# Altium schematic sheet CanController.SchDoc
size A4; CompanyName: HESSO; Address1: Route du Rawyl 47; Address2: 1950 Sion; Address3: Switzerland; DocumentNumber: 4; SheetNumber: 3; SheetTotal: 4; PageSetup: Record=PageOptions|CenterHorizontal=True|CenterVertical=True|PrintScale=1.00|XCorrection=1.00|YCorrection=1.00|PrintKind=1|BorderSize=5000000|LeftOffset=0|BottomOffset=0|Orientation=2|PaperLength=1000|PaperWidth=1000|Scale=100|PaperSource=15|PrintQuality=1200|MediaType=1|DitherType=10|PrintScaleMode=1|PaperKind=A4|PaperIndex=9; ProjectName: Project Name
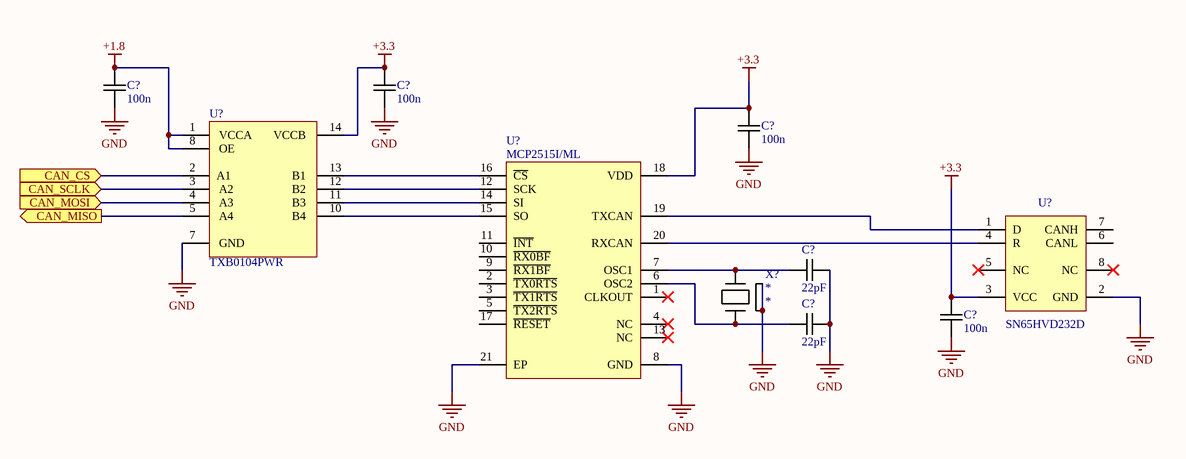
[diagram p0: CanController.SchDoc]

## Parts
(Parts that share a designator on the sheet are numbered #1, #2 ... from top to bottom, then left to right.)
C?#1  100n  [CAPACITOR 1608 REFLOW]
C?#2  100n  [CAPACITOR 1608 REFLOW]
C?#3  100n  [CAPACITOR 1608 REFLOW]
C?#4  22pF  [CAPACITOR 1608 REFLOW]
C?#5  22pF  [CAPACITOR 1608 REFLOW]
C?#6  100n  [CAPACITOR 1608 REFLOW]
U?#1  TXB0104PWR  [TSSOP14 P0.65 C4.4x5.0 H1.1]
U?#2  MCP2515I/ML  [QFN20 P0.5 T2.05x2.05 C4.0x4.0 H0.85]
U?#3  SN65HVD232D  [SO8 P1.27 C4.0X5.0 H1.75]
X?  *  [CRYSTAL C3.2x2.5 Kyocera CX3225SB]

## Ports
CAN_CS (in), CAN_MISO (out), CAN_MOSI (in), CAN_SCLK (in)

## Nets
+1.8: C?#1.2 U?#1.1(VCCA) U?#1.8(OE)
+3.3: C?#2.2 C?#3.2 C?#6.2 U?#1.14(VCCB) U?#2.18(VDD) U?#3.3(VCC)
GND: C?#1.1 C?#2.1 C?#3.1 C?#4.1 C?#5.1 C?#6.1 U?#1.7(GND) U?#2.8(GND) U?#2.21(EP) U?#3.2(GND) X?.2 X?.4
CAN_CS: U?#1.2(A1) ; port CAN_CS
CAN_MISO: U?#1.5(A4) ; port CAN_MISO
CAN_MOSI: U?#1.4(A3) ; port CAN_MOSI
CAN_SCLK: U?#1.3(A2) ; port CAN_SCLK
NetC?#4_2: C?#4.2 U?#2.7(OSC1) X?.3
NetC?#5_2: C?#5.2 U?#2.6(OSC2) X?.1
NetU?#1_10: U?#1.10(B4) U?#2.15(SO)
NetU?#1_11: U?#1.11(B3) U?#2.14(SI)
NetU?#1_12: U?#1.12(B2) U?#2.12(SCK)
NetU?#1_13: U?#1.13(B1) U?#2.16(~{CS})
NetU?#2_19: U?#2.19(TXCAN) U?#3.1(D)
NetU?#2_20: U?#2.20(RXCAN) U?#3.4(R)

Not connected (* = marked no-connect by the designer): U?#2 1(CLKOUT)* 2(~{TX0RTS}) 3(~{TX1RTS}) 4(NC)* 5(~{TX2RTS}) 9(~{RX1BF}) 10(~{RX0BF}) 11(~{INT}) 13(NC)* 17(~{RESET}); U?#3 5(NC)* 6(CANL) 7(CANH) 8(NC)*

## Notes on the sheet
- Date :
- Revision :
- Sheet
- of
- Design by :

## Library data of the parts
C?#1-C?#6 = Capacitor: Value: *
U?#1 = TXB0104PWR: 4-Bit Bidirectional Voltage-Level Translator With utomatic Direction Sensing and ±15-kV ESD Protection; Value: TXB0104PWR
U?#2 = MCP2515I/ML: Stand-Alone CAN Controller with SPI Interface; Value: MCP2515I/ML
U?#3 = SN65HVD232D: CAN Bus Transceiver 3V3; Value: SN65HVD232D
X? = Crystal C3.2x2.5 Kyocera CX3225SB: Value: *